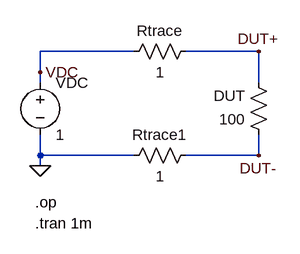
[diagram p0: schematic Lab 2 Experiment 6a.asc]
Lab 2 Experiment 6a.asc, the LTspice schematic file:
Version 4
SHEET 1 880 680
WIRE 224 64 80 64
WIRE 416 64 304 64
WIRE 80 96 80 64
WIRE 80 112 80 96
WIRE 416 112 416 64
WIRE 80 224 80 192
WIRE 224 224 80 224
WIRE 416 224 416 192
WIRE 416 224 304 224
WIRE 80 240 80 224
FLAG 80 240 0
FLAG 416 64 DUT+
FLAG 416 224 DUT-
FLAG 80 96 VDC
SYMBOL voltage 80 96 R0
WINDOW 123 0 0 Left 0
WINDOW 39 0 0 Left 0
SYMATTR InstName VDC
SYMATTR Value 1
SYMBOL res 320 48 R90
WINDOW 0 0 56 VBottom 2
WINDOW 3 32 56 VTop 2
SYMATTR InstName Rtrace
SYMATTR Value 1
SYMBOL res 320 208 R90
WINDOW 0 0 56 VBottom 2
WINDOW 3 32 56 VTop 2
SYMATTR InstName Rtrace1
SYMATTR Value 1
SYMBOL res 432 208 R180
WINDOW 0 36 76 Left 2
WINDOW 3 36 40 Left 2
SYMATTR InstName DUT
SYMATTR Value 100
TEXT 72 296 Left 2 !.op
TEXT 72 328 Left 2 !.tran 1m

The netlist it stands for:
* Lab 2 Experiment 6a.asc
VDC VDC 0 1
Rtrace DUT+ VDC 1
Rtrace1 DUT- 0 1
R§DUT DUT- DUT+ 100
.op
.tran 1m
.backanno
.end